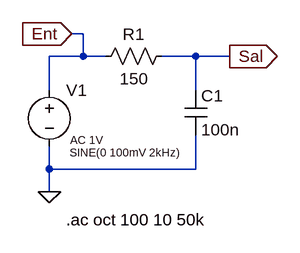
[diagram p0: schematic E1-FPB-RC.asc]
E1-FPB-RC.asc, the LTspice schematic file:
Version 4
SHEET 1 880 680
WIRE -1664 32 -1680 32
WIRE -1664 64 -1664 32
WIRE -1664 64 -1712 64
WIRE -1632 64 -1664 64
WIRE -1504 64 -1552 64
WIRE -1456 64 -1504 64
WIRE -1712 112 -1712 64
WIRE -1504 112 -1504 64
WIRE -1712 224 -1712 192
WIRE -1504 224 -1504 176
WIRE -1504 224 -1712 224
WIRE -1712 256 -1712 224
FLAG -1712 256 0
FLAG -1456 64 Sal
IOPIN -1456 64 Out
FLAG -1680 32 Ent
IOPIN -1680 32 In
SYMBOL voltage -1712 96 R0
WINDOW 123 30 87 Left 1
WINDOW 39 0 0 Left 0
WINDOW 3 29 105 Left 1
SYMATTR Value2 AC 1V
SYMATTR InstName V1
SYMATTR Value SINE(0 100mV 2kHz)
SYMBOL res -1536 48 R90
WINDOW 0 0 56 VBottom 2
WINDOW 3 32 56 VTop 2
SYMATTR InstName R1
SYMATTR Value 150
SYMBOL cap -1520 112 R0
SYMATTR InstName C1
SYMATTR Value 100n
TEXT -1688 296 Left 2 !.ac oct 100 10 50k

The netlist it stands for:
* E1-FPB-RC.asc
V1 Ent 0 SINE(0 100mV 2kHz) AC 1V
R1 Sal Ent 150
C1 Sal 0 100n
.ac oct 100 10 50k
.backanno
.end

* Results of the author's LTspice run, read from the files saved beside the schematic
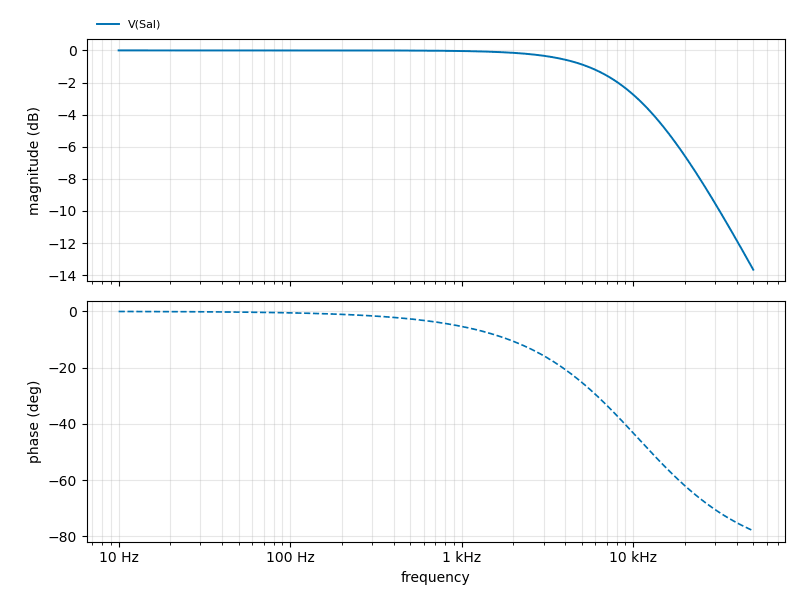
[diagram p1: AC Analysis of E1-FPB-RC.asc, plotted from the saved traces]
* AC Analysis, 1 run:
*   V(Sal): -0.00 dB at 10 Hz, -13.66 dB at 50 kHz, peak -0.00 dB at 10 Hz, 3 dB below the peak at 10.61 kHz